# Altium project G11 Battery Controller.PrjPcb
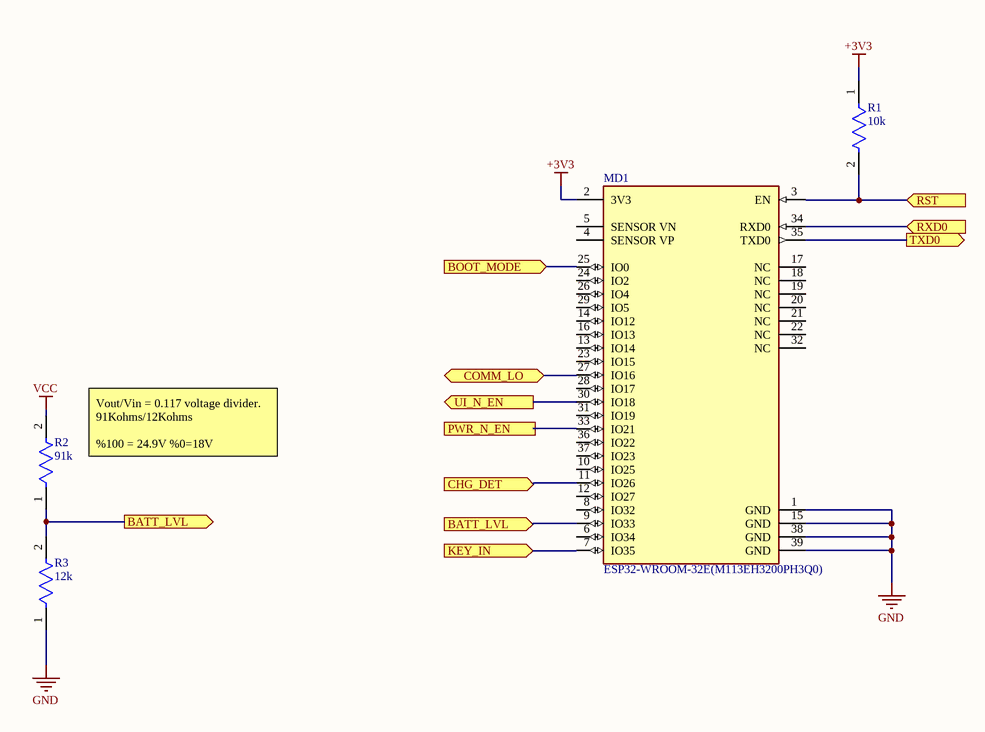
[diagram p0: MCU.SchDoc]
VersionRevision: V0.1; TotalSheet: 5; Title: XIAOMI G11 Battery Controller; Project: XIAOMI G11 Battery Controller; E-Mail: sezginacikgoz@mail.com; DrawnBy: Sezgin AÇIKGÖZ; Company: OpenEYE TECH; CheckedBy: Sezgin AÇIKGÖZ; Address_Website: www.openeye.tech; Address_State_ZIP: 41780; Address_Phone: +905322024183; Address_Country: Turkey; Address_City: Kocaeli
4 sheets, 32 parts. Net scope: flat (ports and power ports of the same name join across sheets).
Board file: PCB1.PcbDoc
Sheets:
  MCU.SchDoc
  POWER.SchDoc
  COMM LEVEL SHIFTER.SchDoc
  CONNECTORS.SchDoc

## Sheet MCU.SchDoc: MCU
size A4; Date: *******; ApprovedBy: *******; Author: *******; CompanyName: *******; Engineer: *******; Organization: *******; Address1: *******; Address2: *******; Address3: *******; Address4: *******; DocumentNumber: 1; Revision: *******; SheetNumber: 1; SheetTotal: 4; CurrentTime: *******; CurrentDate: *******; Time: *******; DocumentFullPathAndName: *******; DocumentName: *******; ModifiedDate: *******; ImagePath: *******; ProjectName: *******; Application_BuildNumber: *******

### Parts
MD1  ESP32-WROOM-32E(M113EH3200PH3Q0)  [FP-ESP32-WROOM-32E_M113EH-MFG]
R1  10k  [FP-RP731J-MFG]
R2  91k  [FP-RP731J-MFG]
R3  12k  [FP-RP731J-MFG]

### Ports
BATT_LVL (in, see MCU[1C]), BATT_LVL (out, see MCU[2C]), BOOT_MODE (in, see CONNECTORS[3B]), CHG_DET (in, see CONNECTORS[2C]), COMM_LO (bidir, see COMM LEVEL SHIFTER[2B]), KEY_IN (in, see CONNECTORS[1B]), PWR_N_EN (out, see POWER[1B]), RST (in, see CONNECTORS[3B]), RXD0 (in, see CONNECTORS[3B]), TXD0 (out, see CONNECTORS[3B]), UI_N_EN (out, see POWER[1D])

### Nets
+3V3: MD1.2(3V3) R1.1
GND: MD1.1(GND) MD1.15(GND) MD1.38(GND) MD1.39(GND) R3.1
VCC: R2.2
BATT_LVL: MD1.9(IO33) R2.1 R3.2 ; port BATT_LVL
BOOT_MODE: MD1.25(IO0) ; port BOOT_MODE
CHG_DET: MD1.11(IO26) ; port CHG_DET
COMM_LO: MD1.27(IO16) ; port COMM_LO
KEY_IN: MD1.7(IO35) ; port KEY_IN
PWR_N_EN: MD1.33(IO21) ; port PWR_N_EN
RST: MD1.3(EN) R1.2 ; port RST
RXD0: MD1.34(RXD0) ; port RXD0
TXD0: MD1.35(TXD0) ; port TXD0
UI_N_EN: MD1.30(IO18) ; port UI_N_EN

Not connected (* = marked no-connect by the designer): MD1 4(SENSOR_VP) 5(SENSOR_VN) 6(IO34) 8(IO32) 10(IO25) 12(IO27) 13(IO14) 14(IO12) 16(IO13) 17(NC) 18(NC) 19(NC) 20(NC) 21(NC) 22(NC) 23(IO15) 24(IO2) 26(IO4) 28(IO17) 29(IO5) 31(IO19) 32(NC) 36(IO22) 37(IO23)

### Notes on the sheet
- (near R2) Vout/Vin = 0.117 voltage divider. 91Kohms/12Kohms
  %100 = 24.9V %0=18V
- Title:
- Drawn By:
- Page Contents:
- Checked By:
- Size:
- Date:
- File:
- License:
- Email:
- A4
- Number:
- Time:
- Revision:
- Sheet
- Website:
- of

### Library data of the parts
MD1 = CMP-194065-000012-1: RX TXRX MOD WIFI TRACE ANT SMD; LCSC Part #: C701341
R1 = CMP-03211-008596-1: TE CONNECTIVITY / HOLSWORTHY SMD Chip Resistor, Thin Film, 8.45Ω, 50 V, 0603 [1608 Metric], 100 mW, 0.1% , RP73 Series; Manufacturer Part Number: RP73D1J8R45BTDG; Temperature Coefficient: 15ppm/°C; Resistance: 10kΩ; Voltage Rating: 75V; Value: 10kΩ; Power Rating: 0.1W; Temperature: -55°C to +105°C; octopart_url: https://octopart.com/rp73d1j8r45btdg-te+connectivity-42630912; packaging: cut tape; Manufacturer: TE Connectivity; Device Class L2: Resistors; Series: RP73; Temperature Range High: +105°C; Package: RP731J; ComponentLink2Description: Datasheet; Octopart: https://octopart.com/rp73d1j8r45btdg-te+connectivity-42630912; Height: 0.55mm; Ipc Land Pattern Name: RESC15580X45; ComponentLink2URL: https://www.te.com/commerce/DocumentDelivery/DDEController?Action=srchrtrv&DocNm=1773272&DocType=DS&DocLang=English; Device Class L3: Chip SMD Resistors; Category: Res; Temperature Range Low: -55°C; RoHS: TRUE; Device Class L1: Passive Components; Tolerance: 0.1%; Composition: Thin Film; Automotive: No; Lead Free: Yes; Case/Package: 603; LCSC Part #: *
R2 = CMP-03211-008596-1: TE CONNECTIVITY / HOLSWORTHY SMD Chip Resistor, Thin Film, 8.45Ω, 50 V, 0603 [1608 Metric], 100 mW, 0.1% , RP73 Series; Manufacturer Part Number: RP73D1J8R45BTDG; Temperature Coefficient: 15ppm/°C; Resistance: 91kΩ; Voltage Rating: 75V; Value: 91kΩ; Power Rating: 0.1W; Temperature: -55°C to +105°C; octopart_url: https://octopart.com/rp73d1j8r45btdg-te+connectivity-42630912; packaging: cut tape; Manufacturer: TE Connectivity; Device Class L2: Resistors; Series: RP73; Temperature Range High: +105°C; Package: 603; ComponentLink2Description: Datasheet; Octopart: https://octopart.com/rp73d1j8r45btdg-te+connectivity-42630912; Height: 0.55mm; Ipc Land Pattern Name: RESC15580X45; ComponentLink2URL: https://www.te.com/commerce/DocumentDelivery/DDEController?Action=srchrtrv&DocNm=1773272&DocType=DS&DocLang=English; Device Class L3: Chip SMD Resistors; Category: Res; Temperature Range Low: -55°C; RoHS: TRUE; Device Class L1: Passive Components; Tolerance: 0.1%; Composition: Thin Film; Automotive: No; Lead Free: Yes; Case/Package: 603; LCSC Part #: *
R3 = CMP-03211-008596-1: TE CONNECTIVITY / HOLSWORTHY SMD Chip Resistor, Thin Film, 8.45Ω, 50 V, 0603 [1608 Metric], 100 mW, 0.1% , RP73 Series; Manufacturer Part Number: RP73D1J8R45BTDG; Temperature Coefficient: 15ppm/°C; Resistance: 12kΩ; Voltage Rating: 75V; Value: 12kΩ; Power Rating: 0.1W; Temperature: -55°C to +105°C; octopart_url: https://octopart.com/rp73d1j8r45btdg-te+connectivity-42630912; packaging: cut tape; Manufacturer: TE Connectivity; Device Class L2: Resistors; Series: RP73; Temperature Range High: +105°C; Package: 603; ComponentLink2Description: Datasheet; Octopart: https://octopart.com/rp73d1j8r45btdg-te+connectivity-42630912; Height: 0.55mm; Ipc Land Pattern Name: RESC15580X45; ComponentLink2URL: https://www.te.com/commerce/DocumentDelivery/DDEController?Action=srchrtrv&DocNm=1773272&DocType=DS&DocLang=English; Device Class L3: Chip SMD Resistors; Category: Res; Temperature Range Low: -55°C; RoHS: TRUE; Device Class L1: Passive Components; Tolerance: 0.1%; Composition: Thin Film; Automotive: No; Lead Free: Yes; Case/Package: 603; LCSC Part #: *

## Sheet POWER.SchDoc: POWER
size A4; Date: *******; ApprovedBy: *******; Author: *******; CompanyName: *******; Engineer: *******; Organization: *******; Address1: *******; Address2: *******; Address3: *******; Address4: *******; DocumentNumber: 2; Revision: *******; SheetNumber: 2; SheetTotal: 4; CurrentTime: *******; CurrentDate: *******; Time: *******; DocumentFullPathAndName: *******; DocumentName: *******; ModifiedDate: *******; ImagePath: *******; ProjectName: *******; Application_BuildNumber: *******
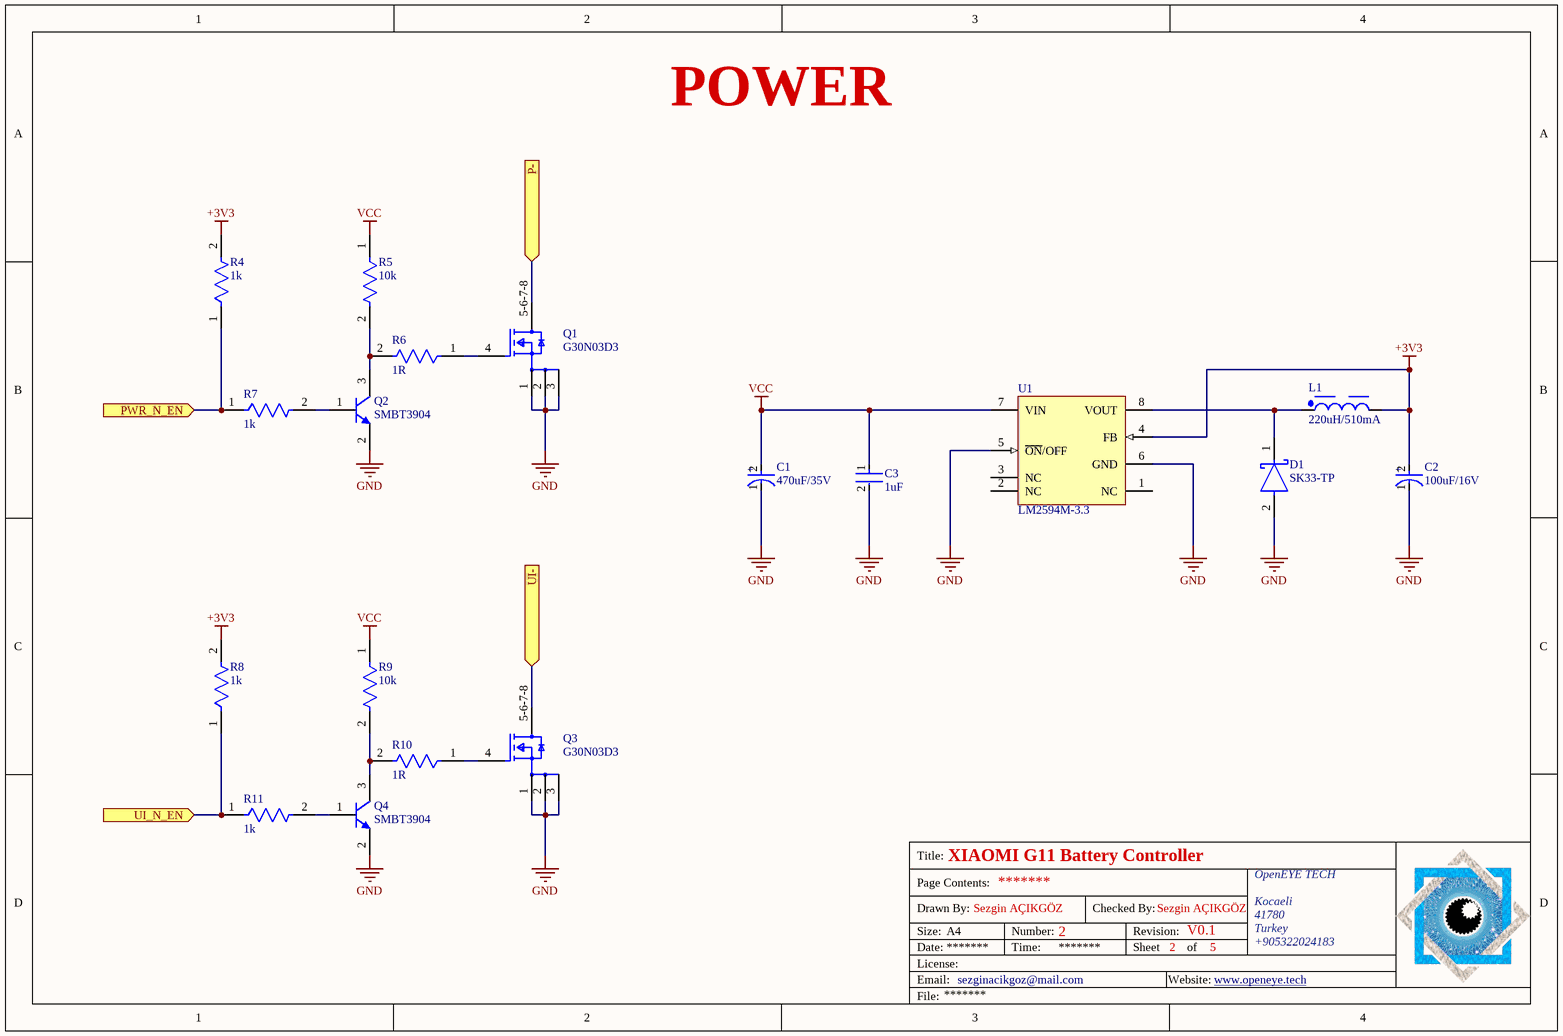
[diagram p1: POWER.SchDoc]

### Parts
C1  470uF/35V  [FP-FKSG-MFG]
C2  100uF/16V  [FP-TAJC-MFG]
C3  1uF  [FP-0603-L_1_6_0_15-W_0_8-IPC_C]
D1  SK33-TP  [FP-SMC-MFG]
L1  220uH/510mA  [WE-PD2_7850]
Q1  G30N03D3  [FP-511AB-MFG]
Q2  SMBT3904  [INF-SOT23_L]
Q3  G30N03D3  [FP-511AB-MFG]
Q4  SMBT3904  [INF-SOT23_L]
R4  1k  [FP-RP731J-MFG]
R5  10k  [FP-RP731J-MFG]
R6  1R  [FP-RP731J-MFG]
R7  1k  [FP-RP731J-MFG]
R8  1k  [FP-RP731J-MFG]
R9  10k  [FP-RP731J-MFG]
R10  1R  [FP-RP731J-MFG]
R11  1k  [FP-RP731J-MFG]
U1  LM2594M-3.3  [D0008A_M]

### Ports
P- (in, see CONNECTORS[1B]), PWR_N_EN (in, see MCU[2C]), UI- (in, see CONNECTORS[1B]), UI_N_EN (in, see MCU[2B])

### Nets
+3V3: C2.2(A) L1.2 R4.2 R8.2 U1.4(FB)
GND: C1.1(C) C2.1(C) C3.2 D1.2(A) Q1.1(S) Q1.2(S) Q1.3(S) Q2.2(E) Q3.1(S) Q3.2(S) Q3.3(S) Q4.2(E) U1.5(~{ON}/OFF) U1.6(GND)
VCC: C1.2(A) C3.1 R5.1 R9.1 U1.7(VIN)
P-: Q1.5-6-7-8(D) ; port P-
PWR_N_EN: R4.1 R7.1 ; port PWR_N_EN
UI-: Q3.5-6-7-8(D) ; port UI-
UI_N_EN: R8.1 R11.1 ; port UI_N_EN
NetD1_1: D1.1(C) L1.1 U1.8(VOUT)
NetQ1_4: Q1.4(G) R6.1
NetQ2_1: Q2.1(B) R7.2
NetQ2_3: Q2.3(C) R5.2 R6.2
NetQ3_4: Q3.4(G) R10.1
NetQ4_1: Q4.1(B) R11.2
NetQ4_3: Q4.3(C) R9.2 R10.2

Not connected (* = marked no-connect by the designer): U1 1(NC) 2(NC) 3(NC)

### Notes on the sheet
- Title:
- Drawn By:
- Page Contents:
- Checked By:
- Size:
- Date:
- File:
- License:
- Email:
- A4
- Number:
- Time:
- Revision:
- Sheet
- Website:
- of
- (in symbol CMP-2100-03691-2) +
- (in symbol CMP-05427-000037-1) +

### Library data of the parts
C1 = CMP-05427-000037-1: CAP ALUM 470UF 20% 35V SMD; Ripple Current: 552.5mA; Life (Hours): 2000Hour; ESR (Equivalent Series Resistance): 80mR; Ripple Current (AC): 850mA; Polarity: Polar; Max Operating Temperature: 105°C; Height - Seated (Max): 0.413inch; Height: 10.2mm; Min Operating Temperature: -55°C; Voltage Rating: 35V; Voltage Rating (DC): 35V; Package Quantity: 500; Packaging: Cut Tape; Tolerance: 20%; Capacitance: 470uF; RoHS Compliant: Yes; Mount: Surface Mount; Case/Package: Radial; Diameter: 10mm; LCSC Part #: C280413
C2 = CMP-2100-03691-2: 100uF 16V  ±10% 1Ω 2312  SMD Tantalum Capacitor; Polarity: Polar; Dissipation Factor: 8%; Leakage Current: 16uA; ESR (Equivalent Series Resistance): 1R; Width: 3.2mm; Case Code (Metric): 6032; Length: 6mm; Case Code (Imperial): 2412; Height: 2.8mm; Series: TAJ; Capacitance: 100uF; Package Quantity: 1; Height - Seated (Max): 0.11inch; Depth: 3.2mm; RoHS Compliant: Yes; Min Operating Temperature: -55°C; Mount: Surface Mount; Termination: SMD/SMT; Packaging: Tape and Reel; Max Operating Temperature: 125°C; Voltage Rating (DC): 16V; Construction: Flat; Radiation Hardening: No; Number of Pins: 2; Lead Free: Lead Free; Tolerance: 10%; Voltage Rating: 16V; Features: General Purpose; REACH SVHC: No SVHC; Case/Package: Molded; LCSC Part #: C122646
C3 = CMP-2000-07531-4: Ceramic Capacitor General Use 1uF ±10% 50V X7R 0603; Series: M; Width: 0.031inch; Mount: Surface Mount; Radiation Hardening: No; Voltage Rating (DC): 50V; Packaging: Tape and Reel; Termination: SMD/SMT; Depth: 0.8mm; Case Code (Metric): 1608; Case Code (Imperial): 0603; Height: 0.8mm; Voltage Rating: 50V; Package Quantity: 1; Halogen Free: Halogen Free; Dielectric: X7R; Min Operating Temperature: -55°C; Length: 1.6mm; Construction: Flat; Tolerance: 10%; Thickness: 0.037inch; Max Operating Temperature: 125°C; Case/Package: 0603; Capacitance: 1uF; RoHS Compliant: Yes; LCSC Part #: C478859
D1 = CMP-56206-000007-1: DIODE SCHOTTKY 30V 3A DO214AB; Max Forward Surge Current (Ifsm): 100A; Peak Reverse Current: 500uA; Element Configuration: Single; Polarity: Standard; Forward Voltage: 500mV; Capacitance: 250pF; Max Surge Current: 100A; Length: 7.11mm; Max Reverse Voltage (DC): 30V; Max Reverse Leakage Current: 500uA; Min Operating Temperature: -55°C; Case/Package: SMC; Mount: Surface Mount; Voltage Rating (DC): 30V; Width: 6.22mm; Package Quantity: 1; Packaging: Tape and Reel; Peak Non-Repetitive Surge Current: 100A; Number of Pins: 2; Current Rating: 3A; Output Current: 3A; Max Repetitive Reverse Voltage (Vrrm): 30V; Forward Current: 3A; Radiation Hardening: No; Height: 2.417mm; Lead Free: Lead Free; Average Rectified Current: 3A; Max Operating Temperature: 150°C; LCSC Part #: C151786
L1 = CMP-0227-00452-2: NexarPartId: 22803417; Current Rating: 510mA; DC Resistance (DCR): 614mΩ; Self Resonant Frequency: 5MHz; Inductance: 220µH; Inductance Tolerance: 10%; Length: 7mm; Resistance: 614mΩ; Height: 5mm; Min Operating Temperature: -40°C; Ambient Temperature Range High: 85°C; Ambient Temperature Range Low: -40°C; Width: 7.8mm; RoHS: Compliant; Packaging: Bulk; Number of Pins: 2; Max Operating Temperature: 125°C; LCSC Part #: C2929444
Q1 Q3 = CMP-00278-71475164-1: C840054; Manufacturer Lifecycle Status: ACTIVE; Max Power Dissipation: 3.2W; Turn-On Delay Time: 9.3ns; Turn-Off Delay Time: 17ns; Gate to Source Voltage (Vgs): 20V; Drain to Source Voltage (Vdss): 40V; Continuous Drain Current (ID): 20A; Drain to Source Resistance: 4.8mΩ; Max Junction Temperature (Tj): 175°C; Input Capacitance: 1.6nF; Rds On Max: 3.8mΩ; Number of Channels: 1; Threshold Voltage: 2V; Lead Free: Lead Free; Schedule B: 8541290080; Number of Pins: 8; Mount: Surface Mount; Power Dissipation: 3.2W; Min Operating Temperature: -55°C; RoHS: Compliant; Drain to Source Breakdown Voltage: 40V; Max Operating Temperature: 175°C; Height: 800µm; Lifecycle Status: Production; NexarPartId: 71475164; REACH SVHC: No SVHC; LCSC Part #: C840054
Q2 = CMP-1178-00005-1: NPN Silicon Switching Transistor, 40 V VCEO, 200 mA IC, SOT23, Reel, Green; Manufacturer: Infineon; VCE: 1 V; VCEO (max): 40 V; IC: 10 mA; ICBO (max): 50 nA; VCBO (max): 60 V; IC (max): 200 mA; VEBO (max): 6 V; Green: TRUE; ComponentLink3URL: http://www.infineon.com/dgdl/SOT23-Package_Overview.pdf?folderId=db3a30431936bc4b0119532290053c66&fileId=db3a30431936bc4b0119533468123c85; ComponentLink3Description: Package Specification; ComponentLink1Description: Manufacturer URL; PackageDescription: 3-Pin Small Outline Transistor Package, 1.3 x 2.9 mm Body, 0.95 mm Pitch; ComponentLink1URL: http://www.infineon.com/; PartNumber: SMBT3904; ComponentLink2URL: http://www.infineon.com/dgdl/smbt3904series_mmbt3904.pdf?folderId=db3a30431441fb5d011445fab851018e&fileId=db3a30431441fb5d0114460005c10191; Polarity: NPN; Packing: Reel; PackageReference: SOT23; ComponentLink2Description: Datasheet; PackageVersion: Apr-08; Mounting Technology: Surface Mount; VCE (max): 1 V; LCSC Part #: C896900
Q4 = CMP-1178-00005-1: C896900; Manufacturer: Infineon; VCE: 1 V; VCEO (max): 40 V; Polarity: NPN; IC: 10 mA; Packing: Reel; ICBO (max): 50 nA; VCBO (max): 60 V; IC (max): 200 mA; VEBO (max): 6 V; Green: TRUE; ComponentLink3URL: http://www.infineon.com/dgdl/SOT23-Package_Overview.pdf?folderId=db3a30431936bc4b0119532290053c66&fileId=db3a30431936bc4b0119533468123c85; ComponentLink3Description: Package Specification; ComponentLink1Description: Manufacturer URL; PackageDescription: 3-Pin Small Outline Transistor Package, 1.3 x 2.9 mm Body, 0.95 mm Pitch; ComponentLink1URL: http://www.infineon.com/; PartNumber: SMBT3904; ComponentLink2URL: http://www.infineon.com/dgdl/smbt3904series_mmbt3904.pdf?folderId=db3a30431441fb5d011445fab851018e&fileId=db3a30431441fb5d0114460005c10191; PackageReference: SOT23; ComponentLink2Description: Datasheet; PackageVersion: Apr-08; Mounting Technology: Surface Mount; VCE (max): 1 V; LCSC Part #: C896900
R4 R7 R8 R11 = CMP-03211-008596-1: Manufacturer: TE Connectivity; Manufacturer Part Number: RP73D1J8R45BTDG; Temperature Coefficient: 15ppm/°C; Resistance: 1kΩ; Voltage Rating: 75V; Value: 1kΩ; Power Rating: 0.1W; Tolerance: 0.1%; Temperature: -55°C to +105°C; octopart_url: https://octopart.com/rp73d1j8r45btdg-te+connectivity-42630912; packaging: cut tape; Device Class L2: Resistors; Series: RP73; Temperature Range High: +105°C; Package: 603; ComponentLink2Description: Datasheet; Octopart: https://octopart.com/rp73d1j8r45btdg-te+connectivity-42630912; Height: 0.55mm; Ipc Land Pattern Name: RESC15580X45; ComponentLink2URL: https://www.te.com/commerce/DocumentDelivery/DDEController?Action=srchrtrv&DocNm=1773272&DocType=DS&DocLang=English; Device Class L3: Chip SMD Resistors; Category: Res; Temperature Range Low: -55°C; RoHS: TRUE; Device Class L1: Passive Components; Composition: Thin Film; Automotive: No; Lead Free: Yes; Case/Package: 603; LCSC Part #: *
R5 R9 = CMP-03211-008596-1: Manufacturer: TE Connectivity; Manufacturer Part Number: RP73D1J8R45BTDG; Temperature Coefficient: 15ppm/°C; Resistance: 10kΩ; Voltage Rating: 75V; Value: 10kΩ; Power Rating: 0.1W; Tolerance: 0.1%; Temperature: -55°C to +105°C; octopart_url: https://octopart.com/rp73d1j8r45btdg-te+connectivity-42630912; packaging: cut tape; Device Class L2: Resistors; Series: RP73; Temperature Range High: +105°C; Package: 603; ComponentLink2Description: Datasheet; Octopart: https://octopart.com/rp73d1j8r45btdg-te+connectivity-42630912; Height: 0.55mm; Ipc Land Pattern Name: RESC15580X45; ComponentLink2URL: https://www.te.com/commerce/DocumentDelivery/DDEController?Action=srchrtrv&DocNm=1773272&DocType=DS&DocLang=English; Device Class L3: Chip SMD Resistors; Category: Res; Temperature Range Low: -55°C; RoHS: TRUE; Device Class L1: Passive Components; Composition: Thin Film; Automotive: No; Lead Free: Yes; Case/Package: 603; LCSC Part #: *
R6 R10 = CMP-03211-008596-1: Manufacturer: TE Connectivity; Manufacturer Part Number: RP73D1J8R45BTDG; Temperature Coefficient: 15ppm/°C; Resistance: 1Ω; Voltage Rating: 75V; Value: 1Ω; Power Rating: 0.1W; Tolerance: 0.1%; Temperature: -55°C to +105°C; octopart_url: https://octopart.com/rp73d1j8r45btdg-te+connectivity-42630912; packaging: cut tape; Device Class L2: Resistors; Series: RP73; Temperature Range High: +105°C; Package: 603; ComponentLink2Description: Datasheet; Octopart: https://octopart.com/rp73d1j8r45btdg-te+connectivity-42630912; Height: 0.55mm; Ipc Land Pattern Name: RESC15580X45; ComponentLink2URL: https://www.te.com/commerce/DocumentDelivery/DDEController?Action=srchrtrv&DocNm=1773272&DocType=DS&DocLang=English; Device Class L3: Chip SMD Resistors; Category: Res; Temperature Range Low: -55°C; RoHS: TRUE; Device Class L1: Passive Components; Composition: Thin Film; Automotive: No; Lead Free: Yes; Case/Package: 603; LCSC Part #: *
U1 = CMP-0069-00878-3: SIMPLE SWITCHER® Power Converter 150 KHz 0.5A Step-Down Voltage Regulator, 8-pin Narrow SOIC; Manufacturer: Texas Instruments; PackageTopMarking: NSZXTT*2594*M-3.3; PowerWise: N; RoHS: N; Code_IPC: SOIC127P600-8; Code_JEDEC: MS-012-AA; PackageDescription: SOIC Narrow, 4.9 x 3.9 x 1.45mm, 8 Lead, 1.27mm Pitch; CompType: Switcher; PackageReference: D0008A; ComponentLink1Description: Datasheet URL; PinCount: 8; ComponentLink1URL: http://www.ti.com/general/docs/lit/getliterature.tsp?genericPartNumber=LM2594&fileType=pdf; LCSC Part #: C3029048

## Sheet COMM LEVEL SHIFTER.SchDoc: Communication & Level Shifter
size A4; Date: *******; ApprovedBy: *******; Author: *******; CompanyName: *******; Engineer: *******; Organization: *******; Address1: *******; Address2: *******; Address3: *******; Address4: *******; DocumentNumber: 3; Revision: *******; SheetNumber: 3; SheetTotal: 4; CurrentTime: *******; CurrentDate: *******; Time: *******; DocumentFullPathAndName: *******; DocumentName: *******; ModifiedDate: *******; ImagePath: *******; ProjectName: *******; Application_BuildNumber: *******
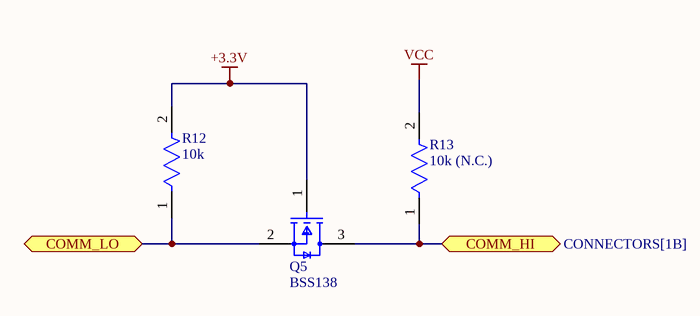
[diagram p2: COMM LEVEL SHIFTER.SchDoc]

### Parts
Q5  BSS138  [FP-318-08-IPC_B]
R12  10k  [FP-RP731J-MFG]
R13  10k (N.C.)  [FP-RP731J-MFG]

### Ports
COMM_HI (bidir, see CONNECTORS[1B]), COMM_LO (bidir, see MCU[2B])

### Nets
+3.3V: Q5.1(G) R12.2
VCC: R13.2
COMM_HI: Q5.3(D) R13.1 ; port COMM_HI
COMM_LO: Q5.2(S) R12.1 ; port COMM_LO

### Notes on the sheet
- Title:
- Drawn By:
- Page Contents:
- Checked By:
- Size:
- Date:
- File:
- License:
- Email:
- A4
- Number:
- Time:
- Revision:
- Sheet
- Website:
- of

### Library data of the parts
Q5 = CMP-07173-000101-1: MOSFET N-CH 50V 220MA SOT-23; Turn-Off Delay Time: 20ns; Element Configuration: Single; Rds On Max: 3.5R; Gate to Source Voltage (Vgs): 20V; Threshold Voltage: 1.3V; Number of Elements: 1; Power Dissipation: 360mW; Rise Time: 9ns; Turn-On Delay Time: 2.5ns; Input Capacitance: 27pF; On-State Resistance: 6R; Lead Free: Lead Free; Length: 2.92mm; Width: 1.3mm; Drain to Source Breakdown Voltage: 50V; Min Operating Temperature: -55°C; REACH SVHC: No SVHC; Packaging: Tape and Reel; Radiation Hardening: No; Height: 0.93mm; Drain to Source Voltage (Vdss): 50V; Current Rating: 220mA; Voltage Rating (DC): 50V; Weight: 0.03g; Continuous Drain Current (ID): 220mA; Number of Pins: 3; Nominal Vgs: 1.3V; Max Power Dissipation: 360mW; Fall Time: 9ns; Drain to Source Resistance: 3.5R; Contact Plating: Tin; Case/Package: SOT-23; Package Quantity: 1; Dual Supply Voltage: 50V; Mount: Surface Mount; Termination: SMD/SMT; Max Operating Temperature: 150°C; LCSC Part #: C5224260
R12 R13 = CMP-03211-008596-1: as R1 on sheet MCU; Temperature: -55°C to +105°C; octopart_url: https://octopart.com/rp73d1j8r45btdg-te+connectivity-42630912; packaging: cut tape; Manufacturer: TE Connectivity; Device Class L2: Resistors; Series: RP73; Temperature Range High: +105°C; Package: 603; ComponentLink2Description: Datasheet; Octopart: https://octopart.com/rp73d1j8r45btdg-te+connectivity-42630912; Height: 0.55mm; Ipc Land Pattern Name: RESC15580X45; ComponentLink2URL: https://www.te.com/commerce/DocumentDelivery/DDEController?Action=srchrtrv&DocNm=1773272&DocType=DS&DocLang=English; Device Class L3: Chip SMD Resistors; Category: Res; Temperature Range Low: -55°C; RoHS: TRUE; Device Class L1: Passive Components; Tolerance: 0.1%; Composition: Thin Film; Automotive: No; Lead Free: Yes; Case/Package: 603; LCSC Part #: *

## Sheet CONNECTORS.SchDoc: Connectors
size A4; Date: *******; ApprovedBy: *******; Author: *******; CompanyName: *******; Engineer: *******; Organization: *******; Address1: *******; Address2: *******; Address3: *******; Address4: *******; DocumentNumber: 4; Revision: *******; SheetNumber: 4; SheetTotal: 4; CurrentTime: *******; CurrentDate: *******; Time: *******; DocumentFullPathAndName: *******; DocumentName: *******; ModifiedDate: *******; ImagePath: *******; ProjectName: *******; Application_BuildNumber: *******
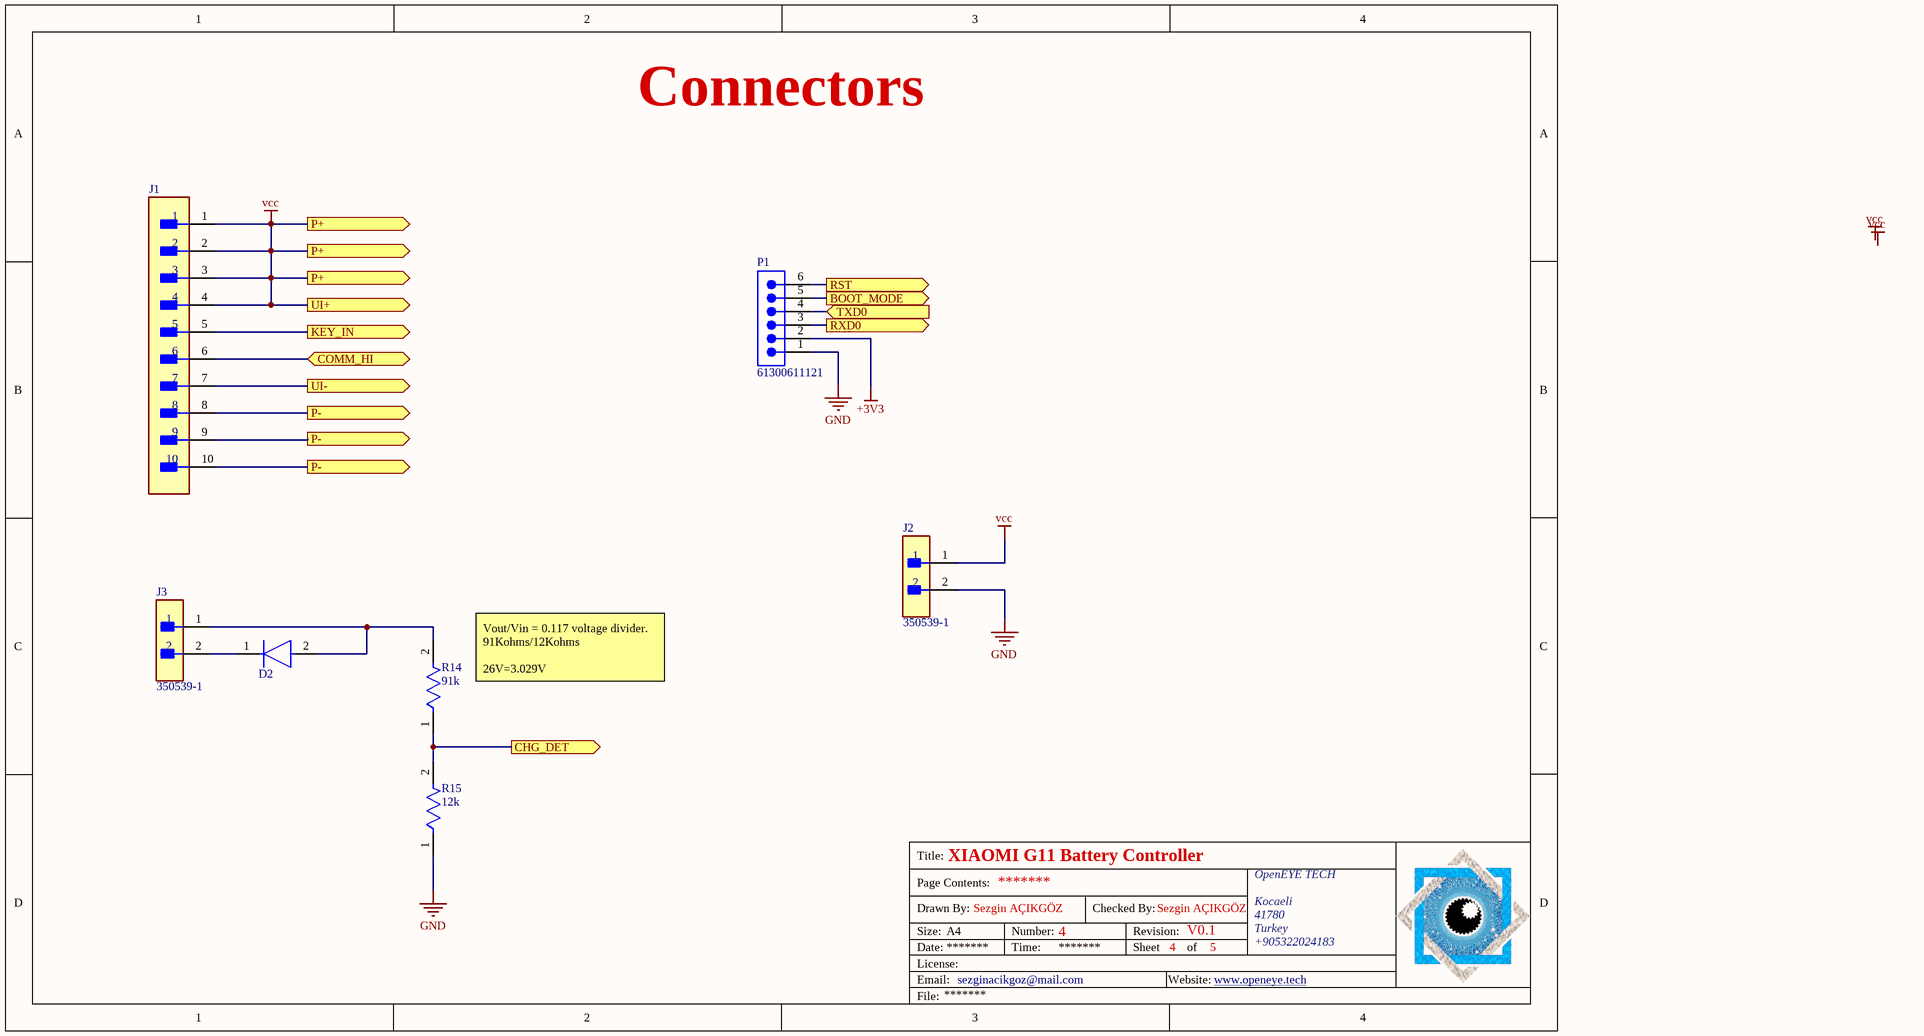
[diagram p3: CONNECTORS.SchDoc]

### Parts
D2  ES2DA-13-F  [FP-SMA-MFG]  (value not drawn)
J1  S10B-PH-K-S(LF)(SN)  [FP-S10B-PH-K-S_LF_SN-MFG]  (value not drawn)
J2  350539-1  [FP-350539-1-MFG]
J3  350539-1  [FP-350539-1-MFG]
P1  61300611121  [61300611121]
R14  91k  [FP-RP731J-MFG]
R15  12k  [FP-RP731J-MFG]

### Ports
BOOT_MODE (out, see MCU[2B]), CHG_DET (out, see MCU[2C]), COMM_HI (bidir, see COMM LEVEL SHIFTER[3B]), KEY_IN (out, see MCU[2C]), P+ (out, see CONNECTORS[1A]), P+ (out, see CONNECTORS[1A], CONNECTORS[1B]), P- (out, see CONNECTORS[1B], POWER[2B]), RST (out, see MCU[3B]), RXD0 (out, see MCU[3B]), TXD0 (in, see MCU[3B]), UI+ (out), UI- (out, see POWER[2C])

### Nets
+3V3: P1.2
GND: J2.2 P1.1 R15.1
VCC: J1.1 J1.2 J1.3 J1.4 J2.1 ; port P+, port UI+
BOOT_MODE: P1.5 ; port BOOT_MODE
CHG_DET: R14.1 R15.2 ; port CHG_DET
COMM_HI: J1.6 ; port COMM_HI
KEY_IN: J1.5 ; port KEY_IN
P-: J1.8 J1.9 J1.10 ; port P-
RST: P1.6 ; port RST
RXD0: P1.3 ; port RXD0
TXD0: P1.4 ; port TXD0
UI-: J1.7 ; port UI-
NetD2_1: D2.1(C) J3.2
NetD2_2: D2.2(A) J3.1 R14.2

### Notes on the sheet
- (near R14) Vout/Vin = 0.117 voltage divider. 91Kohms/12Kohms
  26V=3.029V
- Labels drawn without touching a wire or pin: vcc
- Title:
- Drawn By:
- Page Contents:
- Checked By:
- Size:
- Date:
- File:
- License:
- Email:
- A4
- Number:
- Time:
- Revision:
- Sheet
- Website:
- of

### Library data of the parts
D2 = CMP-12791-000014-1: DIODE GEN PURP 200V 2A SMA; Manufacturer: Diodes Inc.; Value: 25pF; Peak Reverse Current: 5uA; Max Surge Forward Current: 50A; Max Junction Temp: +150°C; Description: 200V 2A Surface Mount Super-Fast Rectifier DO-214AC; Standoff Height: 0.05mm; Forward Current: 2A; Temperature Range High: +150°C; ComponentLink2Description: Datasheet; Footprint Url: https://www.diodes.com/assets/Package-Files/SMA.pdf; ComponentLink2URL: https://www.diodes.com/assets/Datasheets/ds14002.pdf; Max Repetitive Reverse Voltage: 200V; Lead Free: Yes; RoHS: TRUE; Category: Diode; Manufacturer Part Number: ES2DA-13-F; Mouser Description: Rectifiers RECTIFIER SUPER FAST "F" LEAD FREE; Temperature: -55°C to +150°C; Digikey Description: DIODE GEN PURP 200V 2A SMA; Automotive: No; Capacitance: 25pF; Device Class L1: Discrete Semiconductors; Height: 2.4mm; Reverse Voltage: 200V; Octopart: https://octopart.com/es2da-13-f-diodes+inc.-328903; Temperature Range Low: -55°C; Device Class L2: Diodes; Package: SMA; Device Class L3: Rectifier Diodes; LCSC Part #: C5140013
J1 = CMP-17439-000377-2: CONN HEADER R/A 10POS 2MM; Number of Positions: 10; Contact Resistance: 20mR; Gender: Male; Max Current Rating: 2A; Max Voltage Rating (AC): 100V; Number of Pins: 10; Connector Type: Header; Termination: Solder; Number of Rows: 1; Insulation Color: Natural; Flammability Rating: UL94 V-0; Contact Plating: Copper; Packaging: Bulk; Width: 4.5mm; Depth: 7.6mm; Max Operating Temperature: 85°C; Lead Free: Lead Free; Min Operating Temperature: -25°C; Contact Mating Length: 0.13inch; Number of Contacts: 10; Contact Material: Brass; Mount: Through Hole; Contact Shape: Square; Housing Color: White; Orientation: Right Angle; Series: PH; Voltage Rating: 100V; Color: Natural; Insulation Material: Nylon; Housing Material: Polyamide; Current Rating: 2A; Height: 9.4mm; Pitch: 2mm; Contact Finish - Mating: TIN; Length: 21.9mm; Fastening Type: Detent; Contact Type: Male Pin
J2 J3 = CMP-03369-000078-1: CONN HEADER VERT 2POS 5.08MM; Manufacturer: TE Connectivity; Current Rating: 12A; Conn Orientation: Vertical; Number Of Contacts: 2; Conn Gender: Male; Standoff Height: 0.025inch; Voltage Rating: 250V; Description: CONN HEADER 2POS VERT .200 TIN; Category: Conn; Height: 0.41inch; Device Class L3: unset; Number Of Rows: 1; Temperature: -55°C to +105°C; ComponentLink2URL: https://www.te.com/usa-en/product-350539-1.html?te_bu=Cor&te_type=other&te_campaign=oct_glo_cor-oct-global-oth-prtnr-fy19-oct-octo-buy-bom_sma-298_2&elqCampaignId=35216; Manufacturer Part Number: 350539-1; Automotive: No; Mouser Description: Pin & Socket Connectors CONN PCM 2 POS TIN; ComponentLink2Description: Datasheet; Lead Free: Yes; Device Class L1: Connectors; Device Class L2: Headers and Wire Housings; Octopart: https://octopart.com/350539-1-te+connectivity-46510628; Digikey Description: CONN HEADER VERT 2POS 5.08MM; RoHS: TRUE; Temperature Range Low: -55°C; Package: 350539-1; Temperature Range High: +105°C; Contact Material: Gold,Nickel; Pitch: 5.08mm
P1 = CMP-1502-01070-2: NexarPartId: 20084590; Operating Supply Voltage: 250V; Current Rating: 3A; Number of Contacts: 6; Gender: Male; Connector Type: Male Pin; Pitch: 2.54mm; Contact Resistance: 20mΩ; Lead Free: Lead Free; REACH SVHC: Unknown; Number of Rows: 1; Color: Black; Min Operating Temperature: -40°C; Contact Material: Copper; Lead Pitch: 2.54mm; Contact Plating: Gold; Number of Pins: 6; Height: 8.89mm; Orientation: Vertical; Termination: Through Hole; Mount: Through Hole; RoHS: Compliant; Contact Gender: Male; Contact Mating Length: 5.9944mm; Voltage Rating: 250V; Number of Positions: 6; Housing Material: PBT; Packaging: Bulk; Max Operating Temperature: 105°C
R14 = CMP-03211-008596-1: as R2 on sheet MCU; Temperature: -55°C to +105°C; octopart_url: https://octopart.com/rp73d1j8r45btdg-te+connectivity-42630912; packaging: cut tape; Manufacturer: TE Connectivity; Device Class L2: Resistors; Series: RP73; Temperature Range High: +105°C; Package: 603; ComponentLink2Description: Datasheet; Octopart: https://octopart.com/rp73d1j8r45btdg-te+connectivity-42630912; Height: 0.55mm; Ipc Land Pattern Name: RESC15580X45; ComponentLink2URL: https://www.te.com/commerce/DocumentDelivery/DDEController?Action=srchrtrv&DocNm=1773272&DocType=DS&DocLang=English; Device Class L3: Chip SMD Resistors; Category: Res; Temperature Range Low: -55°C; RoHS: TRUE; Device Class L1: Passive Components; Tolerance: 0.1%; Composition: Thin Film; Automotive: No; Lead Free: Yes; Case/Package: 603; LCSC Part #: *
R15 = CMP-03211-008596-1: as R3 on sheet MCU; Temperature: -55°C to +105°C; octopart_url: https://octopart.com/rp73d1j8r45btdg-te+connectivity-42630912; packaging: cut tape; Manufacturer: TE Connectivity; Device Class L2: Resistors; Series: RP73; Temperature Range High: +105°C; Package: 603; ComponentLink2Description: Datasheet; Octopart: https://octopart.com/rp73d1j8r45btdg-te+connectivity-42630912; Height: 0.55mm; Ipc Land Pattern Name: RESC15580X45; ComponentLink2URL: https://www.te.com/commerce/DocumentDelivery/DDEController?Action=srchrtrv&DocNm=1773272&DocType=DS&DocLang=English; Device Class L3: Chip SMD Resistors; Category: Res; Temperature Range Low: -55°C; RoHS: TRUE; Device Class L1: Passive Components; Tolerance: 0.1%; Composition: Thin Film; Automotive: No; Lead Free: Yes; Case/Package: 603; LCSC Part #: *

## Nets that join several sheets
+3V3: MCU (MD1.2 R1.1), POWER (5 pins), CONNECTORS (P1.2)
GND: MCU (5 pins), POWER (14 pins), CONNECTORS (J2.2 P1.1 R15.1)
VCC: MCU (R2.2), POWER (5 pins), COMM LEVEL SHIFTER (R13.2), CONNECTORS (5 pins)
BOOT_MODE: MCU (MD1.25), CONNECTORS (P1.5)
CHG_DET: MCU (MD1.11), CONNECTORS (R14.1 R15.2)
COMM_HI: COMM LEVEL SHIFTER (Q5.3 R13.1), CONNECTORS (J1.6)
COMM_LO: MCU (MD1.27), COMM LEVEL SHIFTER (Q5.2 R12.1)
KEY_IN: MCU (MD1.7), CONNECTORS (J1.5)
P-: POWER (Q1.5-6-7-8), CONNECTORS (J1.8 J1.9 J1.10)
PWR_N_EN: MCU (MD1.33), POWER (R4.1 R7.1)
RST: MCU (MD1.3 R1.2), CONNECTORS (P1.6)
RXD0: MCU (MD1.34), CONNECTORS (P1.3)
TXD0: MCU (MD1.35), CONNECTORS (P1.4)
UI-: POWER (Q3.5-6-7-8), CONNECTORS (J1.7)
UI_N_EN: MCU (MD1.30), POWER (R8.1 R11.1)